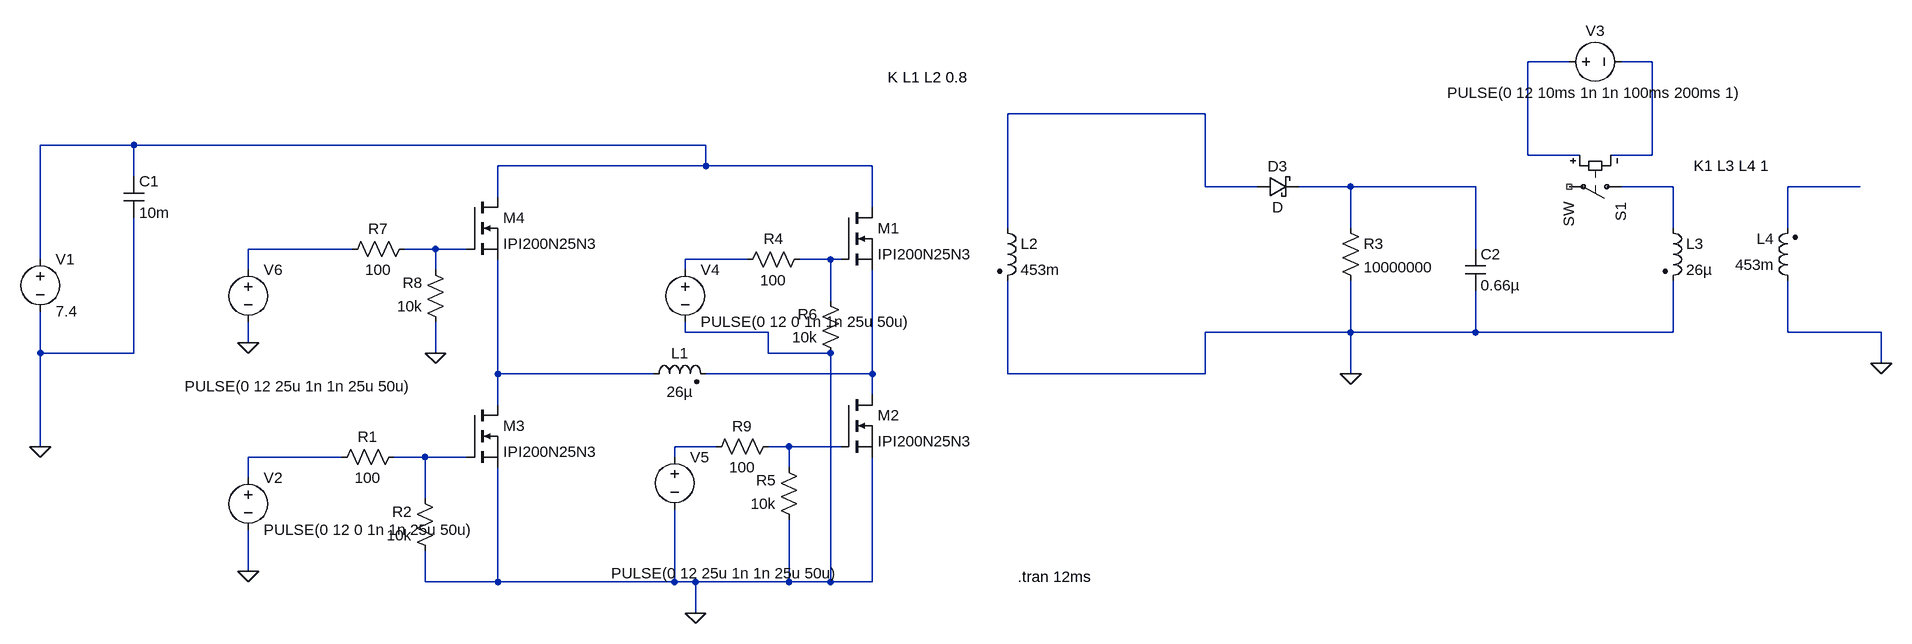
[diagram p0: schematic HVDC.asc]
HVDC.asc, the LTspice schematic file:
Version 4
SHEET 1 1524 680
WIRE 928 -208 864 -208
WIRE 1056 -208 1008 -208
WIRE 368 -128 64 -128
WIRE -1280 -80 -1424 -80
WIRE -400 -80 -1280 -80
WIRE 864 -64 864 -208
WIRE 944 -64 864 -64
WIRE 1056 -64 1056 -208
WIRE 1056 -64 992 -64
WIRE -400 -48 -400 -80
WIRE -400 -48 -720 -48
WIRE -144 -48 -400 -48
WIRE -1280 -32 -1280 -80
WIRE 368 -16 368 -128
WIRE 448 -16 368 -16
WIRE 592 -16 512 -16
WIRE 784 -16 592 -16
WIRE 1088 -16 1008 -16
WIRE 1376 -16 1264 -16
WIRE -720 0 -720 -48
WIRE -144 16 -144 -48
WIRE 64 48 64 -128
WIRE 592 48 592 -16
WIRE 1088 48 1088 -16
WIRE 1264 48 1264 -16
WIRE -944 80 -1104 80
WIRE -816 80 -864 80
WIRE -768 80 -816 80
WIRE 784 80 784 -16
WIRE -1424 96 -1424 -80
WIRE -336 96 -432 96
WIRE -208 96 -256 96
WIRE -192 96 -208 96
WIRE -1104 112 -1104 80
WIRE -816 112 -816 80
WIRE -432 112 -432 96
WIRE -208 160 -208 96
WIRE -432 208 -432 192
WIRE -304 208 -432 208
WIRE 592 208 592 128
WIRE 592 208 368 208
WIRE 784 208 784 144
WIRE 784 208 592 208
WIRE 1088 208 1088 128
WIRE 1088 208 784 208
WIRE 1264 208 1264 128
WIRE 1408 208 1264 208
WIRE -1104 224 -1104 192
WIRE -1424 240 -1424 176
WIRE -1280 240 -1280 32
WIRE -1280 240 -1424 240
WIRE -816 240 -816 192
WIRE -304 240 -304 208
WIRE -208 240 -304 240
WIRE 1408 256 1408 208
WIRE -720 272 -720 96
WIRE -480 272 -720 272
WIRE -144 272 -144 112
WIRE -144 272 -400 272
WIRE 64 272 64 128
WIRE 368 272 368 208
WIRE 368 272 64 272
WIRE 592 272 592 208
WIRE -144 304 -144 272
WIRE -720 320 -720 272
WIRE -1424 384 -1424 240
WIRE -384 384 -448 384
WIRE -272 384 -304 384
WIRE -192 384 -272 384
WIRE -960 400 -1104 400
WIRE -832 400 -880 400
WIRE -768 400 -832 400
WIRE -448 400 -448 384
WIRE -272 416 -272 384
WIRE -1104 432 -1104 400
WIRE -832 464 -832 400
WIRE -1104 576 -1104 512
WIRE -832 592 -832 544
WIRE -720 592 -720 416
WIRE -720 592 -832 592
WIRE -448 592 -448 480
WIRE -448 592 -720 592
WIRE -416 592 -448 592
WIRE -272 592 -272 496
WIRE -272 592 -416 592
WIRE -208 592 -208 240
WIRE -208 592 -272 592
WIRE -144 592 -144 400
WIRE -144 592 -208 592
WIRE -416 640 -416 592
FLAG -1424 384 0
FLAG 592 272 0
FLAG 1408 256 0
FLAG -416 640 0
FLAG -1104 576 0
FLAG -1104 224 0
FLAG -816 240 0
SYMBOL ind2 -496 288 R270
WINDOW 0 32 56 VTop 2
WINDOW 3 4 56 VBottom 2
SYMATTR InstName L1
SYMATTR Value 26µ
SYMATTR Type ind
SYMATTR SpiceLine Rser=0.2
SYMBOL ind2 48 32 R0
SYMATTR InstName L2
SYMATTR Value 453m
SYMATTR Type ind
SYMATTR SpiceLine Rser=1500
SYMBOL cap 768 80 R0
SYMATTR InstName C2
SYMATTR Value 0.66µ
SYMBOL voltage -1424 80 R0
WINDOW 123 0 0 Left 0
WINDOW 39 0 0 Left 0
SYMATTR InstName V1
SYMATTR Value 7.4
SYMBOL nmos -192 16 R0
SYMATTR InstName M1
SYMATTR Value IPI200N25N3
SYMBOL schottky 448 0 R270
WINDOW 0 32 32 VTop 2
WINDOW 3 0 32 VBottom 2
SYMATTR InstName D3
SYMBOL cap -1296 -32 R0
SYMATTR InstName C1
SYMATTR Value 10m
SYMBOL ind2 1072 32 R0
SYMATTR InstName L3
SYMATTR Value 26µ
SYMATTR Type ind
SYMATTR SpiceLine Rser=0.2
SYMBOL ind2 1280 144 R180
WINDOW 0 36 80 Left 2
WINDOW 3 36 40 Left 2
SYMATTR InstName L4
SYMATTR Value 453m
SYMATTR Type ind
SYMATTR SpiceLine Rser=1500
SYMBOL sw 1024 -16 R90
SYMATTR InstName S1
SYMBOL voltage 912 -208 R270
WINDOW 0 32 56 VTop 2
WINDOW 3 -32 56 VBottom 2
WINDOW 123 0 0 Left 0
WINDOW 39 0 0 Left 0
SYMATTR InstName V3
SYMATTR Value PULSE(0 12 10ms 1n 1n 100ms 200ms 1)
SYMBOL res 576 32 R0
SYMATTR InstName R3
SYMATTR Value 10000000
SYMBOL nmos -192 304 R0
SYMATTR InstName M2
SYMATTR Value IPI200N25N3
SYMBOL nmos -768 320 R0
SYMATTR InstName M3
SYMATTR Value IPI200N25N3
SYMBOL nmos -768 0 R0
SYMATTR InstName M4
SYMATTR Value IPI200N25N3
SYMBOL voltage -1104 416 R0
WINDOW 123 0 0 Left 0
WINDOW 39 0 0 Left 0
SYMATTR InstName V2
SYMATTR Value PULSE(0 12 0 1n 1n 25u 50u)
SYMBOL res -864 384 R90
WINDOW 0 0 56 VBottom 2
WINDOW 3 32 56 VTop 2
SYMATTR InstName R1
SYMATTR Value 100
SYMBOL res -816 560 R180
WINDOW 0 36 76 Left 2
WINDOW 3 36 40 Left 2
SYMATTR InstName R2
SYMATTR Value 10k
SYMBOL res -240 80 R90
WINDOW 0 0 56 VBottom 2
WINDOW 3 32 56 VTop 2
SYMATTR InstName R4
SYMATTR Value 100
SYMBOL res -256 512 R180
WINDOW 0 36 76 Left 2
WINDOW 3 36 40 Left 2
SYMATTR InstName R5
SYMATTR Value 10k
SYMBOL res -192 256 R180
WINDOW 0 36 76 Left 2
WINDOW 3 36 40 Left 2
SYMATTR InstName R6
SYMATTR Value 10k
SYMBOL voltage -1104 96 R0
WINDOW 3 -98 195 Left 2
WINDOW 123 0 0 Left 0
WINDOW 39 0 0 Left 0
SYMATTR Value PULSE(0 12 25u 1n 1n 25u 50u)
SYMATTR InstName V6
SYMBOL res -848 64 R90
WINDOW 0 0 56 VBottom 2
WINDOW 3 32 56 VTop 2
SYMATTR InstName R7
SYMATTR Value 100
SYMBOL res -800 208 R180
WINDOW 0 36 76 Left 2
WINDOW 3 36 40 Left 2
SYMATTR InstName R8
SYMATTR Value 10k
SYMBOL res -288 368 R90
WINDOW 0 0 56 VBottom 2
WINDOW 3 32 56 VTop 2
SYMATTR InstName R9
SYMATTR Value 100
SYMBOL voltage -432 96 R0
WINDOW 123 0 0 Left 0
WINDOW 39 0 0 Left 0
SYMATTR InstName V4
SYMATTR Value PULSE(0 12 0 1n 1n 25u 50u)
SYMBOL voltage -448 384 R0
WINDOW 3 -98 195 Left 2
WINDOW 123 0 0 Left 0
WINDOW 39 0 0 Left 0
SYMATTR Value PULSE(0 12 25u 1n 1n 25u 50u)
SYMATTR InstName V5
TEXT 80 584 Left 2 !.tran 12ms
TEXT -120 -184 Left 2 !K L1 L2 0.8
TEXT 1120 -48 Left 2 !K1 L3 L4 1

The netlist it stands for:
* HVDC.asc
L1 N012 N013 26µ Rser=0.2
L2 N003 0 453m Rser=1500
C2 N005 0 0.66µ
V1 N004 0 7.4
M1 N004 N011 N013 N013 IPI200N25N3
D3 N003 N005 D
C1 N004 0 10m
L3 N006 0 26µ Rser=0.2
L4 0 N007 453m Rser=1500
S1 N006 NC_01 N001 N002 SW
V3 N001 N002 PULSE(0 12 10ms 1n 1n 100ms 200ms 1)
R3 N005 0 10000000
M2 N013 N015 0 0 IPI200N25N3
M3 N012 N017 0 0 IPI200N25N3
M4 N004 N009 N012 N012 IPI200N25N3
V2 N016 0 PULSE(0 12 0 1n 1n 25u 50u)
R1 N017 N016 100
R2 0 N017 10k
R4 N011 N010 100
R5 0 N015 10k
R6 0 N011 10k
V6 N008 0 PULSE(0 12 25u 1n 1n 25u 50u)
R7 N009 N008 100
R8 0 N009 10k
R9 N015 N014 100
V4 N010 0 PULSE(0 12 0 1n 1n 25u 50u)
V5 N014 0 PULSE(0 12 25u 1n 1n 25u 50u)
.model D D
.lib standard.dio
.model NMOS NMOS
.model PMOS PMOS
.lib standard.mos
.tran 12ms
K L1 L2 0.8
K1 L3 L4 1
.backanno
.end